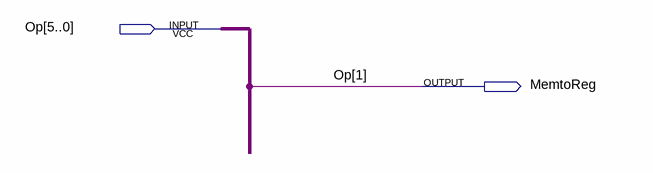
[diagram p0: schematic sheet]
// Quartus schematic MemtoRegDecoder.bdf as structural Verilog: 0 symbols, 2 pins
module MemtoRegDecoder (
  input  [5:0] Op,
  output MemtoReg
);


  assign MemtoReg = Op[1];
endmodule
